# EAGLE design ADK_MEGA_2560-REV3 (EAGLE 6.5.0)
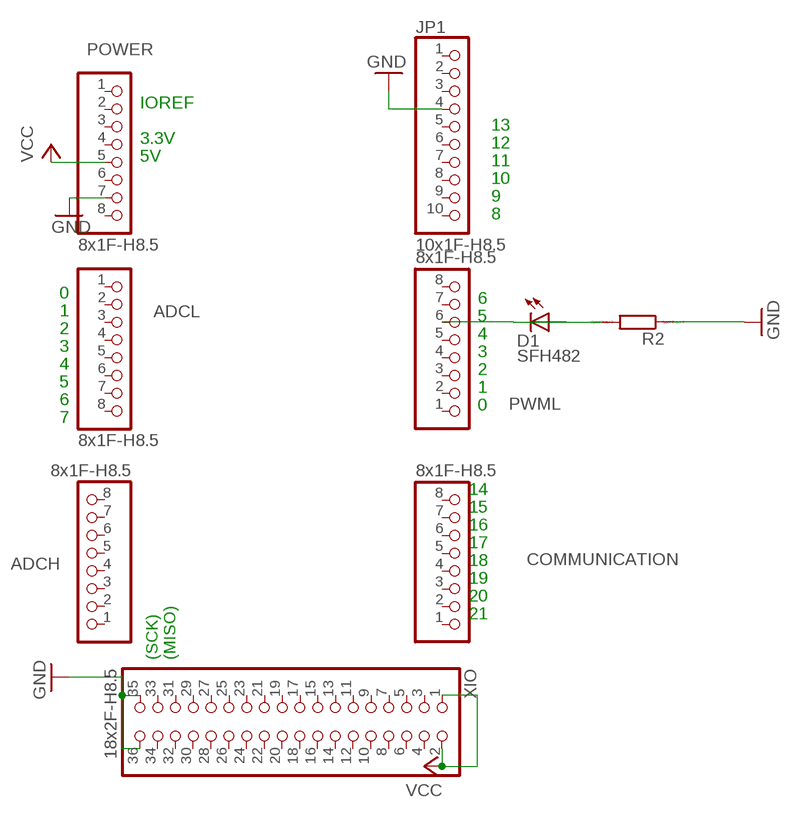
[diagram p0: schematic, sheet 1]

## Parts
ADCH  8x1F-H8.5  PINHD-1X8  [1X08]
ADCL  8x1F-H8.5  PINHD-1X8  [1X08]
COMMUNICATION  8x1F-H8.5  PINHD-1X8  [1X08]
D1  SFH482  [SFH482]
JP1  10x1F-H8.5  PINHD-1X10  [1X10]
POWER  8x1F-H8.5  PINHD-1X8  [1X08]
PWML  8x1F-H8.5  PINHD-1X8  [1X08]
R2  R0204/7  [0204/7]
XIO  18x2F-H8.5  PINHD-2X18  [2X18]

## Nets
GND: JP1.4 POWER.7 R2.1 XIO.35 XIO.36
N$2: D1.K(C) PWML.6
N$3: D1.A R2.2
VCC: POWER.5 XIO.1 XIO.2
Unconnected: ADCH.1 ADCH.2 ADCH.3 ADCH.4 ADCH.5 ADCH.6 ADCH.7 ADCH.8 ADCL.1 ADCL.2 ADCL.3 ADCL.4 ADCL.5 ADCL.6 ADCL.7 ADCL.8 COMMUNICATION.1 COMMUNICATION.2 COMMUNICATION.3 COMMUNICATION.4 COMMUNICATION.5 COMMUNICATION.6 COMMUNICATION.7 COMMUNICATION.8 JP1.1 JP1.2 JP1.3 JP1.5 JP1.6 JP1.7 JP1.8 JP1.9 JP1.10 POWER.1 POWER.2 POWER.3 POWER.4 POWER.6 POWER.8 PWML.1 PWML.2 PWML.3 PWML.4 PWML.5 PWML.7 PWML.8 XIO.3 XIO.4 XIO.5 XIO.6 XIO.7 XIO.8 XIO.9 XIO.10 XIO.11 XIO.12 XIO.13 XIO.14 XIO.15 XIO.16 XIO.17 XIO.18 XIO.19 XIO.20 XIO.21 XIO.22 XIO.23 XIO.24 XIO.25 XIO.26 XIO.27 XIO.28 XIO.29 XIO.30 XIO.31 XIO.32 XIO.33 XIO.34

## Notes on the sheet
- IOREF
- 13
- 3.3V | 12
- 5V | 11
- 10
- 9
- 8
- 0
- 1 | 6
- 2 | 5
- 3 | 4
- 4 | 3
- 5 | 2
- 6 | 1
- 7 | 0
- 14
- 15
- 16
- 17
- 18
- 19
- 20
- 21
- (SCK) | (MISO)

## Library data of the parts
ADCH ADCL COMMUNICATION POWER PWML = SmartPrj:PINHD-1X8: PIN HEADER
D1 = led:SFH482: IR LED infrared emitting diode, Infineon
JP1 = SmartPrj:PINHD-1X10: PIN HEADER
R2 = eagle-ltspice:R: RESISTOR, European symbol; SPICEMODEL: NONE; SPICEPREFIX: R
XIO = SmartPrj:PINHD-2X18: PIN HEADER

## Net classes
0 default: width 0.203 mm, drill 0.406 mm, clearance 0.178 mm
1 power: width 0.305 mm, drill 0.406 mm, clearance 0.178 mm
2 gnd: width 0.305 mm, drill 0.406 mm, clearance 0.178 mm
3 power usb: width 0.508 mm, drill 0.406 mm, clearance 0.178 mm

## Board
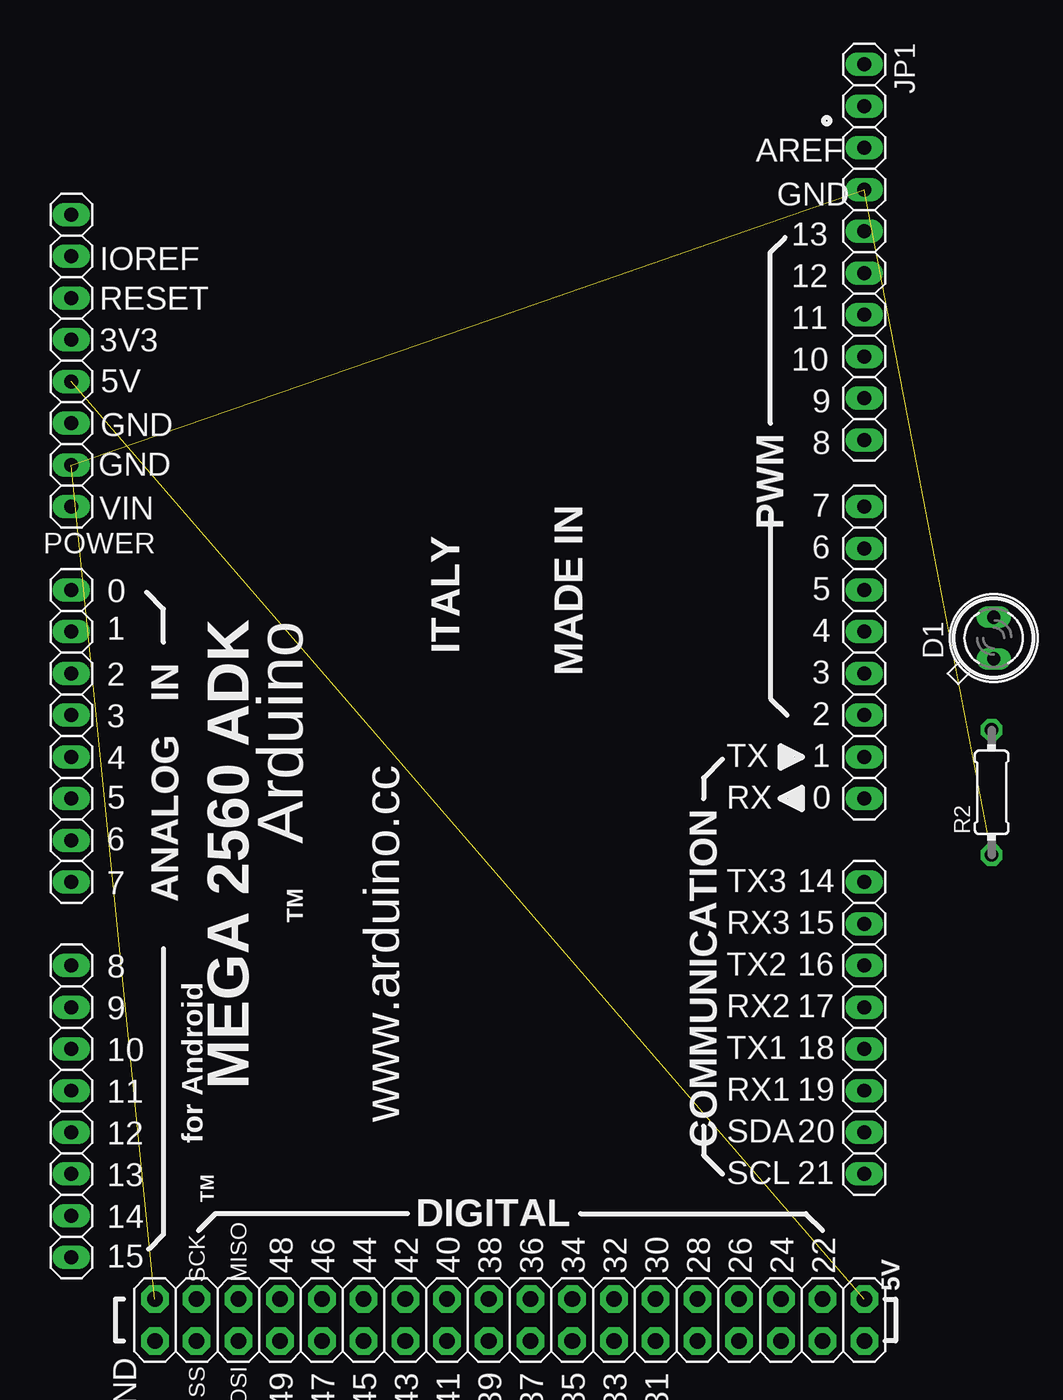
[diagram p1: board, top side]
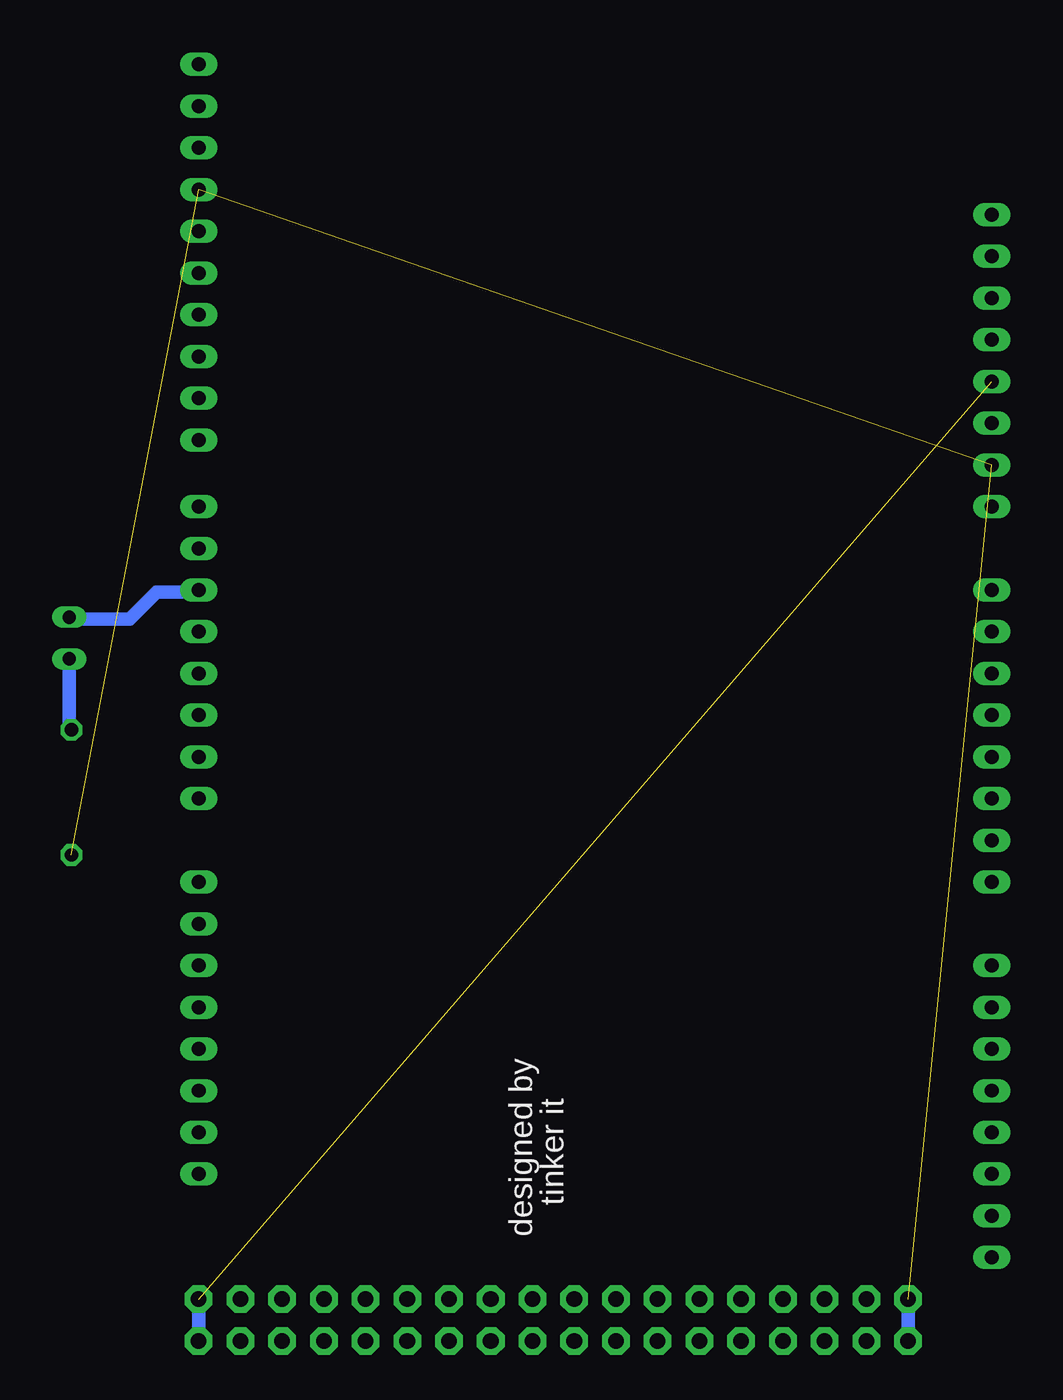
[diagram p2: board, bottom side, seen from below]

No outline drawn. Coordinates in mm, seen from the top.
Copper layers (1*16): Top 0.035mm / dielectric 1.5mm / Bottom 0.035mm
Design rules "ArduinoMegaHOST *": minimum track width 8mil, minimum drill 16mil, track to track 7mil, track to pad 7mil, pad to pad 7mil, via to via 10mil, smd to smd 7mil, copper to edge 20mil, drill to drill 12mil, minimum pad ring 10mil, minimum via ring 10mil, stop-mask expansion 2mil, vias tented up to drill 20mil, thermal gap 10mil

### Footprints (pad centres in the part's own frame; a part is rotated, then mirrored left to right if it is on the bottom)
1X08 = drill 0.85 pad 1.422 long: 1 -8.89,0; 2 -6.35,0; 3 -3.81,0; 4 -1.27,0; 5 1.27,0; 6 3.81,0; 7 6.35,0; 8 8.89,0
SFH482 = drill 0.813 long: A -1.27,0; K 1.27,0
1X10 = drill 0.85 pad 1.422 long: 1 -11.43,0; 2 -8.89,0; 3 -6.35,0; 4 -3.81,0; 5 -1.27,0; 6 1.27,0; 7 3.81,0; 8 6.35,0; 9 8.89,0; 10 11.43,0
0204/7 = drill 0.813 octagon: 1 -3.81,0; 2 3.81,0
2X18 = drill 0.95 pad 1.676 octagon: 1 -21.59,-1.27; 2 -21.59,1.27; 3 -19.05,-1.27; 4 -19.05,1.27; 5 -16.51,-1.27; 6 -16.51,1.27; 7 -13.97,-1.27; 8 -13.97,1.27; 9 -11.43,-1.27; 10 -11.43,1.27; 11 -8.89,-1.27; 12 -8.89,1.27; 13 -6.35,-1.27; 14 -6.35,1.27; 15 -3.81,-1.27; 16 -3.81,1.27; 17 -1.27,-1.27; 18 -1.27,1.27; 19 1.27,-1.27; 20 1.27,1.27; 21 3.81,-1.27; 22 3.81,1.27; 23 6.35,-1.27; 24 6.35,1.27; 25 8.89,-1.27; 26 8.89,1.27; 27 11.43,-1.27; 28 11.43,1.27; 29 13.97,-1.27; 30 13.97,1.27; 31 16.51,-1.27; 32 16.51,1.27; 33 19.05,-1.27; 34 19.05,1.27; 35 21.59,-1.27; 36 21.59,1.27

### Placement (x,y rotation side)
ADCH  6.1,19.43 270 top
ADCL  6.1,42.29 270 top
COMMUNICATION  54.36,24.51 90 top
D1  62.23,48.26 90 top
JP1  54.36,71.75 270 top
POWER  6.1,65.15 270 top
PWML  54.36,47.37 90 top
R2  62.1,38.86 90 top
XIO  32.77,6.73 180 top

### Tracks (layer width: path | path; a pad name or v marks a point on that pad's centre or on a via)
GND  (3 unrouted)
  Bottom 0.813: XIO.35 XIO.36 11.43,5.21
N$2
  Bottom 0.813: PWML.6 54.48,51.05 56.9,51.05 58.55,49.4 62.1,49.4 D1.K
N$3
  Bottom 0.813: D1.A 62.23,42.8 R2.2
VCC  (1 unrouted)
  Bottom 0.813: XIO.2 XIO.1

### Text on the board
tNames: AREF | GND | 13 | IOREF | 12 | RESET | 11 | 3V3 | 10 | 5V | 9 | GND | PWM | 8 | GND | MADE IN | 7 | VIN | ITALY | 6 | 5 | 0 | MEGA 2560 ADK | Arduino | 1 | 4 | ANALOG IN | 2 | 3 | 3 | 2 | www.arduino.cc | 4 | TX | 1 | 5 | RX | 0 | 6 | 7 | TM | TX3 | 14 | RX3 | 15 | 8 | TX2 | 16 | for Android | 9 | RX2 | 17 | TX1 | 18 | 10 | 11 | RX1 | 19 | SDA | 20 | 12 | TM | 13 | SCL | 21 | MISO | 14 | SCK | 48 | 46 | 44 | 42 | DIGITAL | 40 | 38 | 36 | 34 | 32 | 30 | 28 | 26 | 24 | 22 | 15 | 5V | GND | SS | MOSI | 49 | 47 | 45 | 43 | 41 | 39 | 37 | 35 | 33 | 31
bNames: tinker it | designed by